# EAGLE design working (EAGLE 5.11)
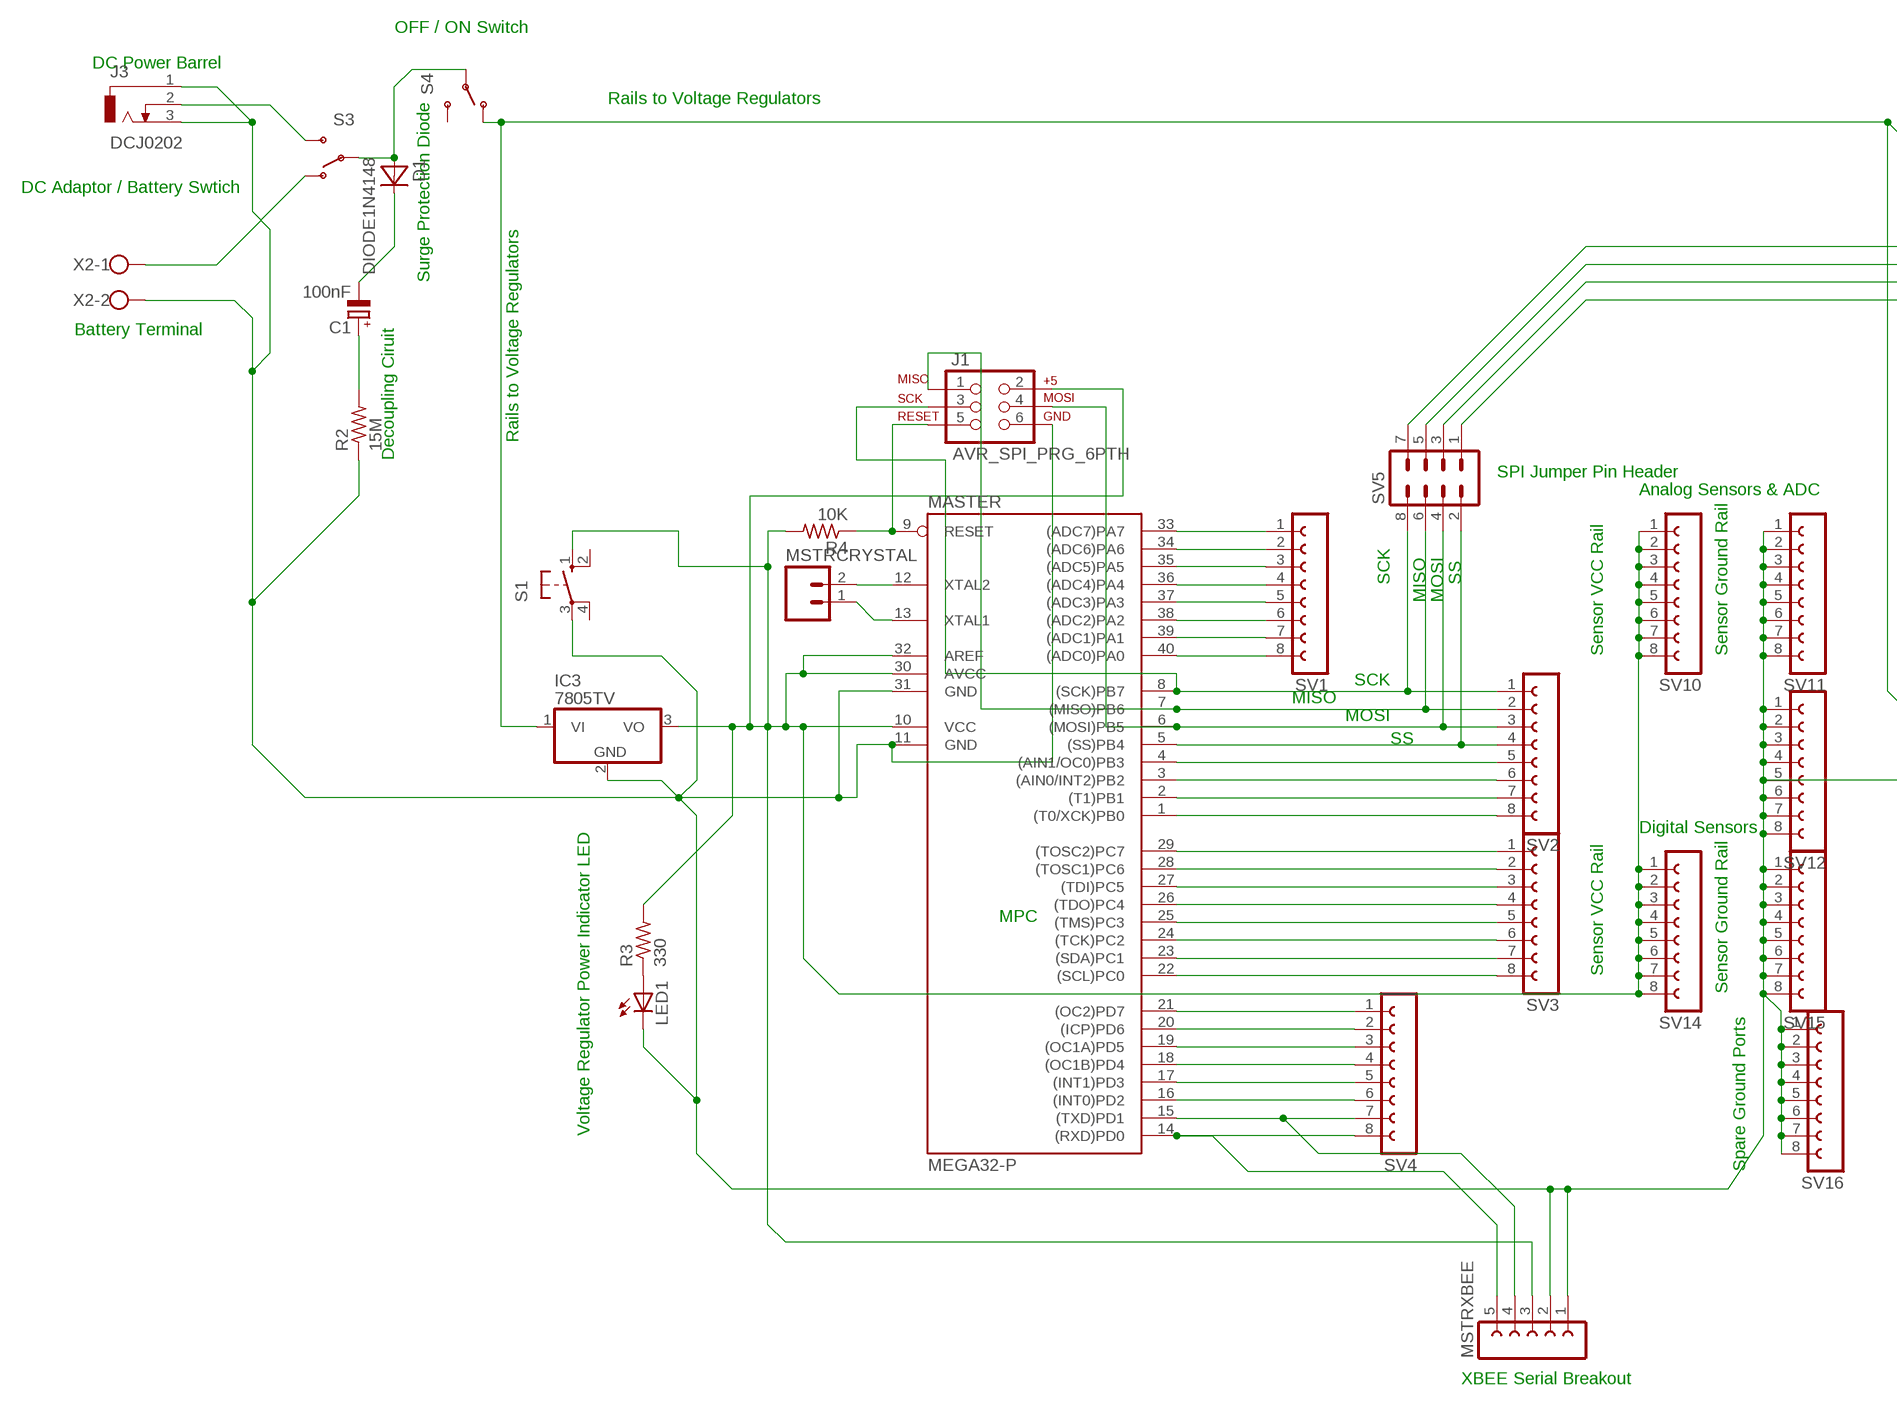
[diagram p0: schematic, sheet 1, part 1 of 2]
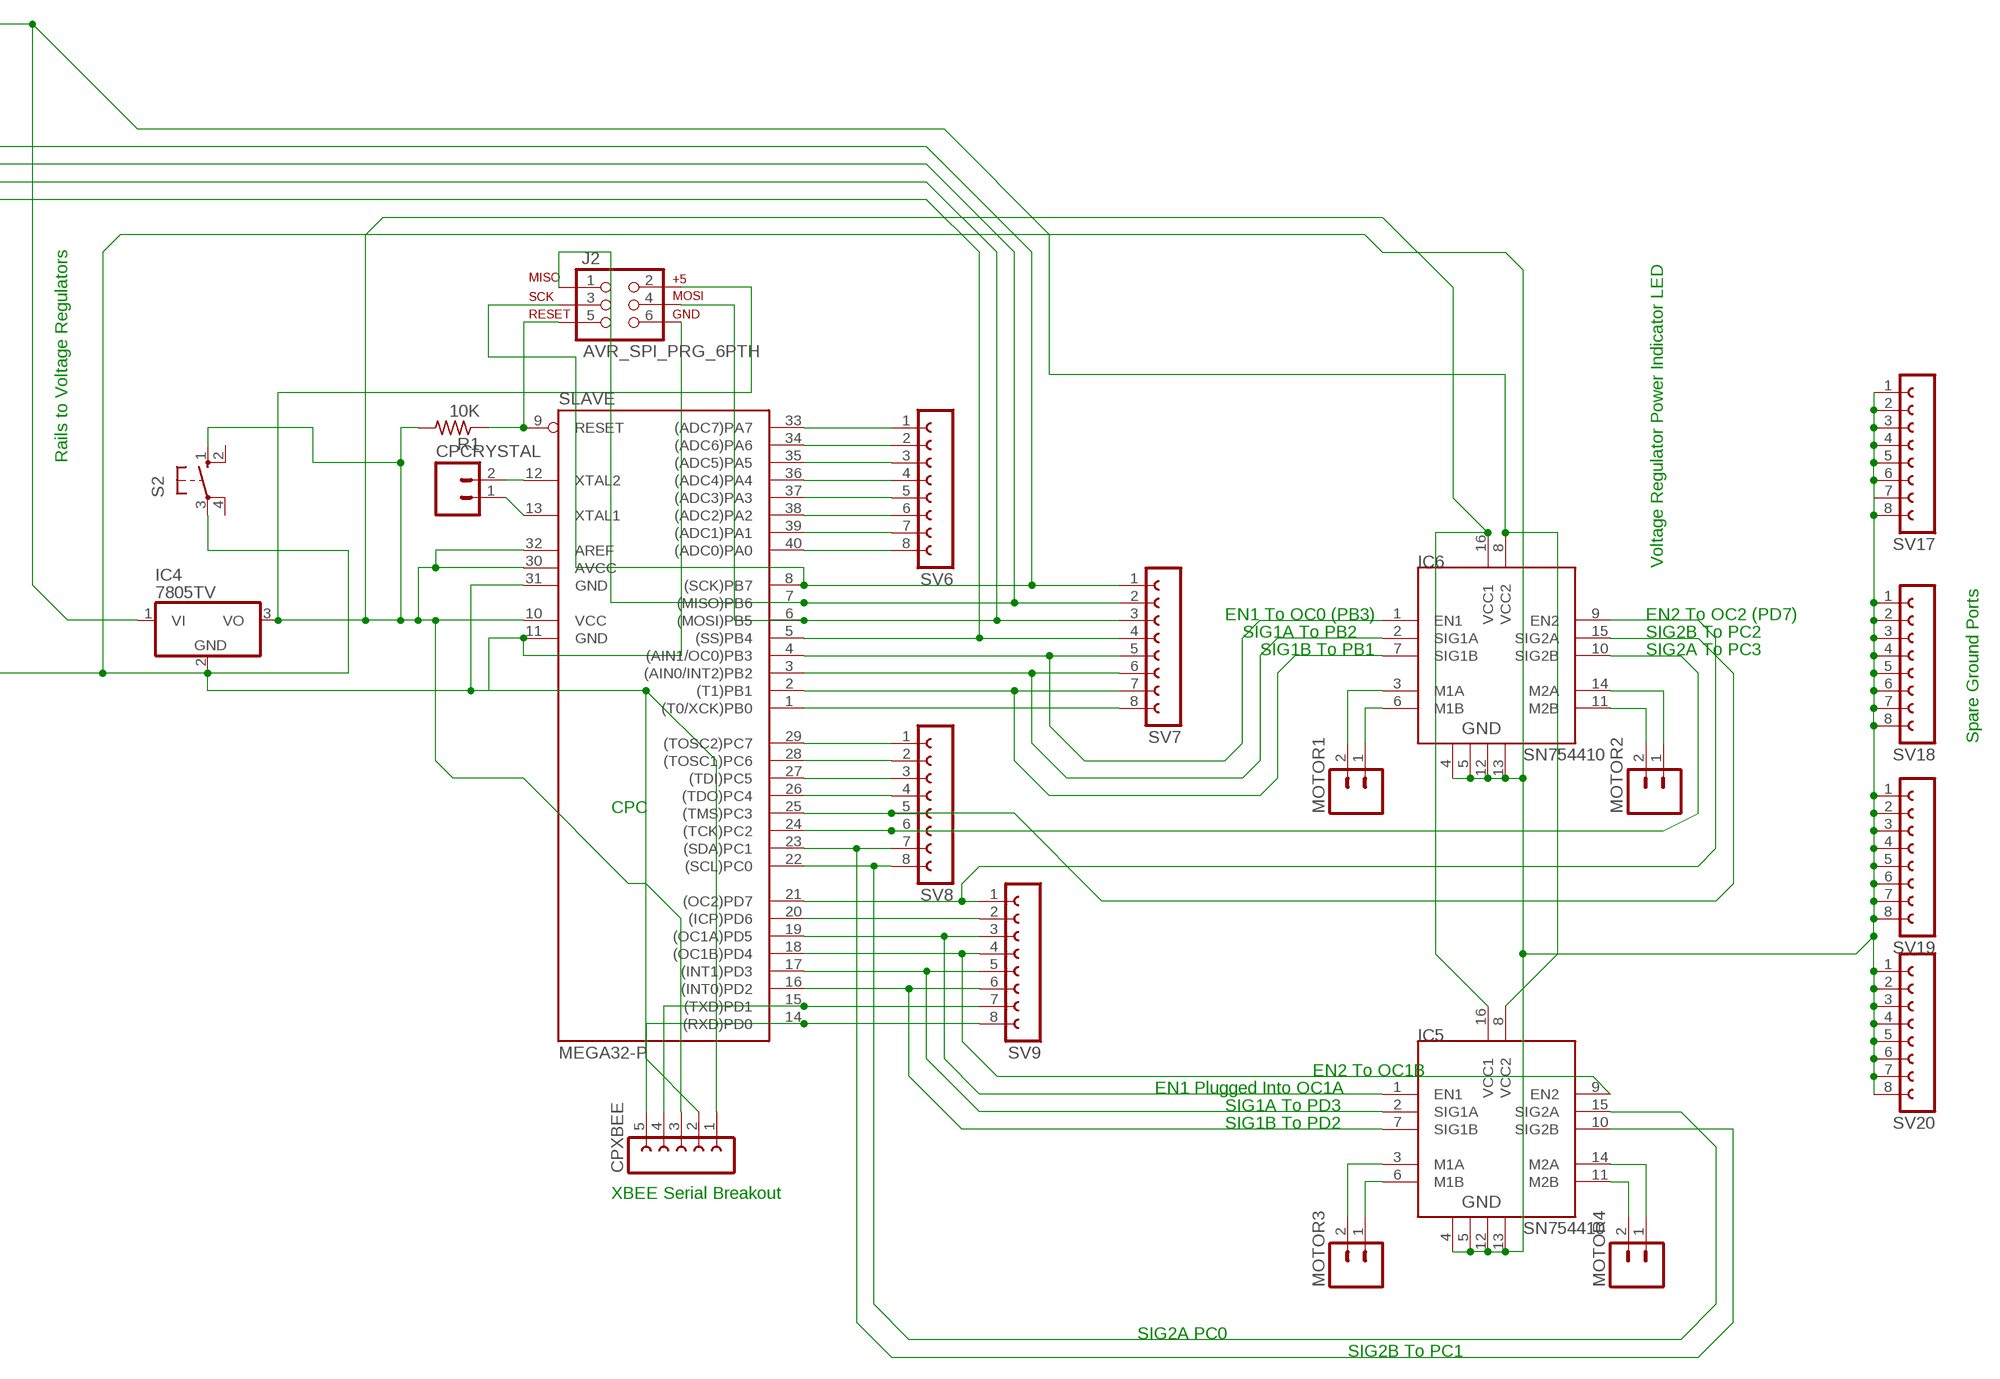
[diagram p1: schematic, sheet 1, part 2 of 2]

## Parts
C1  100nF  CPOL-EUE1.8-4  [E1,8-4]
CPCRYSTAL  M02PTH  [1X02]
CPXBEE  FE05-1  [FE05-1]
D1  DIODE1N4148  [DO-35]
IC3  7805TV  [TO220V]
IC4  7805TV  [TO220V]
IC5  SN754410  [DIP16]
IC6  SN754410  [DIP16]
J1  AVR_SPI_PRG_6PTH  [2X3]
J2  AVR_SPI_PRG_6PTH  [2X3]
J3  DCJ0202  [DCJ0202]
LED1  LED5MM  [LED5MM]
MASTER  MEGA32-P  [DIL40]
MOTOR1  M02PTH  [1X02]
MOTOR2  M02PTH  [1X02]
MOTOR3  M02PTH  [1X02]
MOTOR4  M02PTH  [1X02]
MSTRCRYSTAL  M02PTH  [1X02]
MSTRXBEE  FE05-1  [FE05-1]
R1  10K  R-US_0204/7  [0204/7]
R2  15M  R-US_0204/7  [0204/7]
R3  330  R-US_0204/7  [0204/7]
R4  10K  R-US_0204/7  [0204/7]
S1  10-XX  [B3F-10XX]
S2  10-XX  [B3F-10XX]
S3  SWITCH-SPSTPTH  [SWITCH-SPDT]
S4  SWITCH-SPSTPTH  [SWITCH-SPDT]
SLAVE  MEGA32-P  [DIL40]
SV1  FE08-1  [FE08]
SV2  FE08-1  [FE08]
SV3  FE08-1  [FE08]
SV4  FE08-1  [FE08]
SV5  MA04-2  [MA04-2]
SV6  FE08-1  [FE08]
SV7  FE08-1  [FE08]
SV8  FE08-1  [FE08]
SV9  FE08-1  [FE08]
SV10  FE08-1  [FE08]
SV11  FE08-1  [FE08]
SV12  FE08-1  [FE08]
SV14  FE08-1  [FE08]
SV15  FE08-1  [FE08]
SV16  FE08-1  [FE08]
SV17  FE08-1  [FE08]
SV18  FE08-1  [FE08]
SV19  FE08-1  [FE08]
SV20  FE08-1  [FE08]
X2  W237-102  [W237-102]

## Nets
GND: CPXBEE.1 CPXBEE.2 IC3.2(GND) IC4.2(GND) IC5.4 IC5.5 IC5.12 IC5.13 IC6.4 IC6.5 IC6.12 IC6.13 J1.6 J2.6 J3.1 J3.3 LED1.K(C) MASTER.11(GND) MASTER.31(GND) MSTRXBEE.1 MSTRXBEE.2 R2.1 S1.3(P) S2.3(P) SLAVE.11(GND) SLAVE.31(GND) SV11.1 SV11.2 SV11.3 SV11.4 SV11.5 SV11.6 SV11.7 SV11.8 SV12.1 SV12.2 SV12.3 SV12.4 SV12.5 SV12.6 SV12.7 SV12.8 SV15.1 SV15.2 SV15.3 SV15.4 SV15.5 SV15.6 SV15.7 SV15.8 SV16.1 SV16.2 SV16.3 SV16.4 SV16.5 SV16.6 SV16.7 SV16.8 SV17.1 SV17.2 SV17.3 SV17.4 SV17.5 SV17.6 SV17.8 SV18.1 SV18.2 SV18.3 SV18.4 SV18.5 SV18.6 SV18.7 SV18.8 SV19.1 SV19.2 SV19.3 SV19.4 SV19.5 SV19.6 SV19.7 SV19.8 SV20.1 SV20.2 SV20.3 SV20.4 SV20.5 SV20.6 SV20.7 SV20.8 X2.2
N$1: LED1.A R3.1
N$3: MASTER.40((ADC0)PA0) SV1.8
N$4: MASTER.39((ADC1)PA1) SV1.7
N$5: J1.5 MASTER.9(RESET) R4.1
N$6: MASTER.38((ADC2)PA2) SV1.6
N$7: MASTER.37((ADC3)PA3) SV1.5
N$9: MASTER.36((ADC4)PA4) SV1.4
N$10: MASTER.35((ADC5)PA5) SV1.3
N$11: MASTER.34((ADC6)PA6) SV1.2
N$12: MASTER.33((ADC7)PA7) SV1.1
N$13: CPXBEE.3 IC4.3(VO) IC5.16(VCC1) IC6.16(VCC1) J2.2 R1.2 S2.1(S) SLAVE.10(VCC) SLAVE.30(AVCC) SLAVE.32(AREF)
N$14: J1.4 MASTER.6((MOSI)PB5) SV2.3 SV5.4
N$15: J1.1 MASTER.7((MISO)PB6) SV2.2 SV5.6
N$16: J1.3 MASTER.8((SCK)PB7) SV2.1 SV5.8
N$17: MASTER.5((SS)PB4) SV2.4 SV5.2
N$18: MASTER.4((AIN1/OC0)PB3) SV2.5
N$19: MASTER.3((AIN0/INT2)PB2) SV2.6
N$20: MASTER.2((T1)PB1) SV2.7
N$21: MASTER.1((T0/XCK)PB0) SV2.8
N$22: MASTER.29((TOSC2)PC7) SV3.1
N$23: MASTER.28((TOSC1)PC6) SV3.2
N$24: MASTER.27((TDI)PC5) SV3.3
N$25: MASTER.26((TDO)PC4) SV3.4
N$26: MASTER.25((TMS)PC3) SV3.5
N$28: MASTER.24((TCK)PC2) SV3.6
N$29: MASTER.23((SDA)PC1) SV3.7
N$30: MASTER.22((SCL)PC0) SV3.8
N$31: MASTER.21((OC2)PD7) SV4.1
N$32: MASTER.20((ICP)PD6) SV4.2
N$33: MASTER.19((OC1A)PD5) SV4.3
N$34: MASTER.18((OC1B)PD4) SV4.4
N$35: MASTER.17((INT1)PD3) SV4.5
N$36: MASTER.16((INT0)PD2) SV4.6
N$37: MASTER.15((TXD)PD1) MSTRXBEE.4 SV4.7
N$38: MASTER.14((RXD)PD0) MSTRXBEE.5 SV4.8
N$40: C1.- D1.-
N$45: J2.5 R1.1 SLAVE.9(RESET)
N$46: SLAVE.40((ADC0)PA0) SV6.8
N$47: SLAVE.39((ADC1)PA1) SV6.7
N$48: SLAVE.38((ADC2)PA2) SV6.6
N$49: SLAVE.37((ADC3)PA3) SV6.5
N$50: SLAVE.36((ADC4)PA4) SV6.4
N$51: SLAVE.35((ADC5)PA5) SV6.3
N$52: SLAVE.34((ADC6)PA6) SV6.2
N$53: SLAVE.33((ADC7)PA7) SV6.1
N$54: J2.4 SLAVE.6((MOSI)PB5) SV5.3 SV7.3
N$55: J2.1 SLAVE.7((MISO)PB6) SV5.5 SV7.2
N$56: J2.3 SLAVE.8((SCK)PB7) SV5.7 SV7.1
N$57: SLAVE.5((SS)PB4) SV5.1 SV7.4
N$58: IC6.1(EN1) SLAVE.4((AIN1/OC0)PB3) SV7.5
N$59: D1.+ S3.2(P) S4.2(P)
N$60: IC6.7(SIG1B) SLAVE.2((T1)PB1) SV7.7
N$61: SLAVE.1((T0/XCK)PB0) SV7.8
N$62: SLAVE.29((TOSC2)PC7) SV8.1
N$63: SLAVE.28((TOSC1)PC6) SV8.2
N$64: SLAVE.27((TDI)PC5) SV8.3
N$65: SLAVE.26((TDO)PC4) SV8.4
N$66: IC6.15(SIG2A) SLAVE.25((TMS)PC3) SV8.5
N$67: IC6.10(SIG2B) SLAVE.24((TCK)PC2) SV8.6
N$68: IC5.10(SIG2B) SLAVE.23((SDA)PC1) SV8.7
N$69: IC5.15(SIG2A) SLAVE.22((SCL)PC0) SV8.8
N$70: IC6.9(EN2) SLAVE.21((OC2)PD7) SV9.1
N$71: SLAVE.20((ICP)PD6) SV9.2
N$72: IC5.1(EN1) SLAVE.19((OC1A)PD5) SV9.3
N$73: IC5.9(EN2) SLAVE.18((OC1B)PD4) SV9.4
N$75: C1.+ R2.2
N$76: IC5.7(SIG1B) SLAVE.16((INT0)PD2) SV9.6
N$77: CPXBEE.4 SLAVE.15((TXD)PD1) SV9.7
N$78: CPXBEE.5 SLAVE.14((RXD)PD0) SV9.8
N$79: IC3.1(VI) IC4.1(VI) IC5.8(VCC2) IC6.8(VCC2) S4.1(O)
N$80: IC5.14(M2A) MOTOR4.1
N$81: IC5.11(M2B) MOTOR4.2
N$82: J3.2 S3.3(S)
N$83: IC6.14(M2A) MOTOR2.1
N$84: IC6.11(M2B) MOTOR2.2
N$85: IC6.2(SIG1A) SLAVE.3((AIN0/INT2)PB2) SV7.6
N$86: IC5.6(M1B) MOTOR3.1
N$87: IC5.2(SIG1A) SLAVE.17((INT1)PD3) SV9.5
N$89: IC5.3(M1A) MOTOR3.2
N$90: IC6.6(M1B) MOTOR1.1
N$91: IC6.3(M1A) MOTOR1.2
N$93: S3.1(O) X2.1
N$94: MASTER.12(XTAL2) MSTRCRYSTAL.2
N$95: MASTER.13(XTAL1) MSTRCRYSTAL.1
N$96: CPCRYSTAL.2 SLAVE.12(XTAL2)
N$97: CPCRYSTAL.1 SLAVE.13(XTAL1)
N$98: IC3.3(VO) J1.2 MASTER.10(VCC) MASTER.30(AVCC) MASTER.32(AREF) MSTRXBEE.3 R3.2 R4.2 S1.1(S) SV10.1 SV10.2 SV10.3 SV10.4 SV10.5 SV10.6 SV10.7 SV10.8 SV14.1 SV14.2 SV14.3 SV14.4 SV14.5 SV14.6 SV14.7 SV14.8
Unconnected: S1.2(S1) S1.4(P1) S2.2(S1) S2.4(P1) S4.3(S) SV17.7

## Notes on the sheet
- OFF / ON Switch
- DC Power Barrel
- Rails to Voltage Regulators
- DC Adaptor / Battery Swtich
- Surge Protection Diode
- Battery Terminal
- Rails to Voltage Regulators
- Decoupling Ciruit
- SPI Jumper Pin Header
- Analog Sensors & ADC
- Rails to Voltage Regulators
- SCK | SS
- MISO | MOSI
- Sensor VCC Rail | Sensor Ground Rail
- SCK | Voltage Regulator Power Indicator LED
- MISO
- MOSI
- EN1 To OC0 (PB3) | EN2 To OC2 (PD7)
- SS | SIG1A To PB2 | SIG2B To PC2
- SIG1B To PB1 | SIG2A To PC3
- Digital Sensors
- Spare Ground Ports
- MPC | CPC
- Sensor VCC Rail
- Sensor Ground Rail
- Voltage Regulator Power Indicator LED
- Spare Ground Ports
- EN2 To OC1B
- EN1 Plugged Into OC1A
- SIG1A To PD3
- SIG1B To PD2
- XBEE Serial Breakout
- XBEE Serial Breakout
- SIG2A PC0
- SIG2B To PC1

## Library data of the parts
C1 = rcl:CPOL-EU: POLARIZED CAPACITOR, European symbol
CPCRYSTAL MOTOR1-MOTOR4 MSTRCRYSTAL = SparkFun:M02: Header 2 Standard 2-pin 0.1" header. Use with straight break away headers (SKU : PRT-00116), right angle break away headers (PRT-00553), swiss pins (PRT-00743), machine pins (PRT-00117), and female headers (PRT-00115). Molex polarized connector foot print use with SKU : PRT-08233 with associated crimp pins and housings.
CPXBEE MSTRXBEE = con-lsta:FE05-1: FEMALE HEADER; OC_FARNELL: unknown; OC_NEWARK: unknown
D1 = Diodes:DIODE: Diode; SPICE: D{NAME} {+.NET} {-.NET} 1N4148; SPICEMOD: .model 1N4148 D (IS=0.1PA, RS=16 CJO=2PF TT=12N BV=100 IBV=1nA)
IC3 IC4 = linear:78*: Positive VOLTAGE REGULATOR Source: http://cache.national.com/ds/LM/LM78L05.pdf http://www.fairchildsemi.com/ds/LM/LM7805.pdf
IC5 IC6 = HBridge:SN754410: Quadruple half-H driver
J1 J2 = SparkFun:AVR_SPI_PRG_6: AVR ISP 6 Pin This is the reduced ISP connector for AVR programming. Common on Arduino. This footprint will take up less PCB space and can be used with a 10-pin to 6-pin adapter such as SKU: BOB-08508
J3 = con-jack:DCJ0202: DC POWER JACK Source: DCJ0202.pdf; OC_FARNELL: unknown; OC_NEWARK: unknown
LED1 = led:LED: LED OSRAM: - CHIPLED LG R971, LG N971, LY N971, LG Q971, LY Q971, LO R971, LY R971 LH N974, LH R974 LS Q976, LO Q976, LY Q976 LO Q996 - Hyper CHIPLED LW Q18S LB Q993, LB Q99A, LB R99A - SideLED LS A670, LO A670, LY A670, LG A670, LP A670 LB A673, LV A673, LT A673, LW A673 LH A674 LY A675 LS A676, LA A676, LO A676, LY A676, LW A676 LS A679, LY A679, LG A679 - Hyper Micro SIDELED® LS Y876, LA Y876, LO Y876, LY Y876 LT Y87S - SmartLED LW L88C, LW L88S LB L89C, LB L89S, LG L890 LS L89K, LO L89K, LY L89K LS L896, LA L896, LO L896, LY L896 - TOPLED LS T670, LO T670, LY T670, LG T670, LP T670 LSG T670, LSP T670, LSY T670, LOP T670, LYG T670 LG T671, LOG T671, LSG T671 LB T673, LV T673, LT T673, LW T673 LH T674 LS T676, LA T676, LO T676, LY T676, LB T676, LH T676, LSB T676, LW T676 LB T67C, LV T67C, LT T67C, LS T67K, LO T67K, LY T67K, LW E67C LS E67B, LA E67B, LO E67B, LY E67B, LB E67C, LV E67C, LT E67C LW T67C LS T679, LY T679, LG T679 LS T770, LO T770, LY T770, LG T770, LP T770 LB T773, LV T773, LT T773, LW T773 LH T774 LS E675, LA E675, LY E675, LS T675 LS T776, LA T776, LO T776, LY T776, LB T776 LHGB T686 LT T68C, LB T68C - Hyper Mini TOPLED® LB M676 - Mini TOPLED Santana® LG M470 LS M47K, LO M47K, LY M47K Source: http://www.osram.convergy.de LUXEON: - LUMILED® LXK2-PW12-R00, LXK2-PW12-S00, LXK2-PW14-U00, LXK2-PW14-V00 LXK2-PM12-R00, LXK2-PM12-S00, LXK2-PM14-U00 LXK2-PE12-Q00, LXK2-PE12-R00, LXK2-PE12-S00, LXK2-PE14-T00, LXK2-PE14-U00 LXK2-PB12-K00, LXK2-PB12-L00, LXK2-PB12-M00, LXK2-PB14-N00, LXK2-PB14-P00, LXK2-PB14-Q00 LXK2-PR12-L00, LXK2-PR12-M00, LXK2-PR14-Q00, LXK2-PR14-R00 LXK2-PD12-Q00, LXK2-PD12-R00, LXK2-PD12-S00 LXK2-PH12-R00, LXK2-PH12-S00 LXK2-PL12-P00, LXK2-PL12-Q00, LXK2-PL12-R00 Source: www.luxeon.com KINGBRIGHT: KA-3528ASYC Source: www.kingbright.com
MASTER SLAVE = atmel:MEGA32-P: MICROCONTROLLER 32 Kbytes FLASH 2 Kbytes SRAM 1 Kbytes EEPROM USART 8-channel 10 bit ADC Source: www.atmel.com .. doc2503.pdf; MPN: ATMEGA32-16PU; OC_FARNELL: 1661729; OC_NEWARK: 51P1794
R1-R4 = resistor:R-US_: RESISTOR, American symbol
S1 S2 = switch-omron:10-XX: OMRON SWITCH; MPN: B3F-1000; OC_FARNELL: 176432; OC_NEWARK: 36M3542
S3 S4 = SparkFun:SWITCH-SPST: SPST Switch Simple slide switch. Spark Fun Electronics SKU : COM-00102
SV1-SV4 SV6-SV12 SV14-SV20 = con-lsta:FE08-1: FEMALE HEADER; OC_FARNELL: unknown; OC_NEWARK: unknown
SV5 = con-lstb:MA04-2: PIN HEADER; OC_FARNELL: unknown; OC_NEWARK: unknown
X2 = con-wago-500:W237-102: WAGO SCREW CLAMP; MPN: 237-102; OC_FARNELL: unknown; OC_NEWARK: 70K9898

## Board
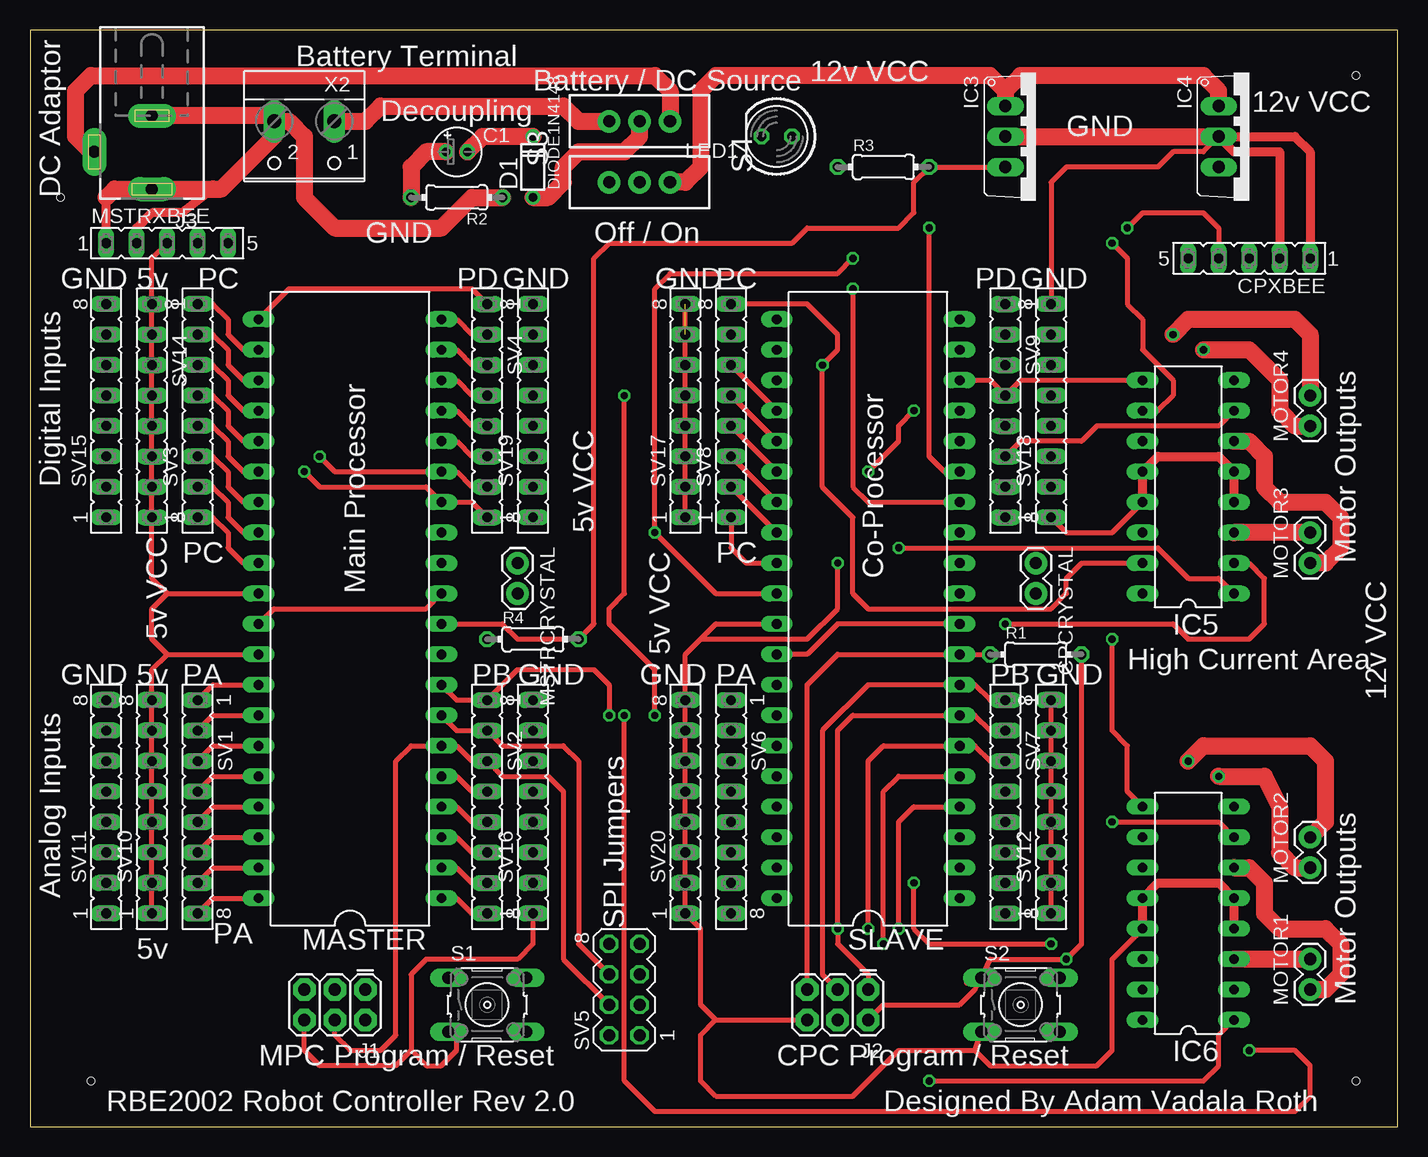
[diagram p2: board, top side]
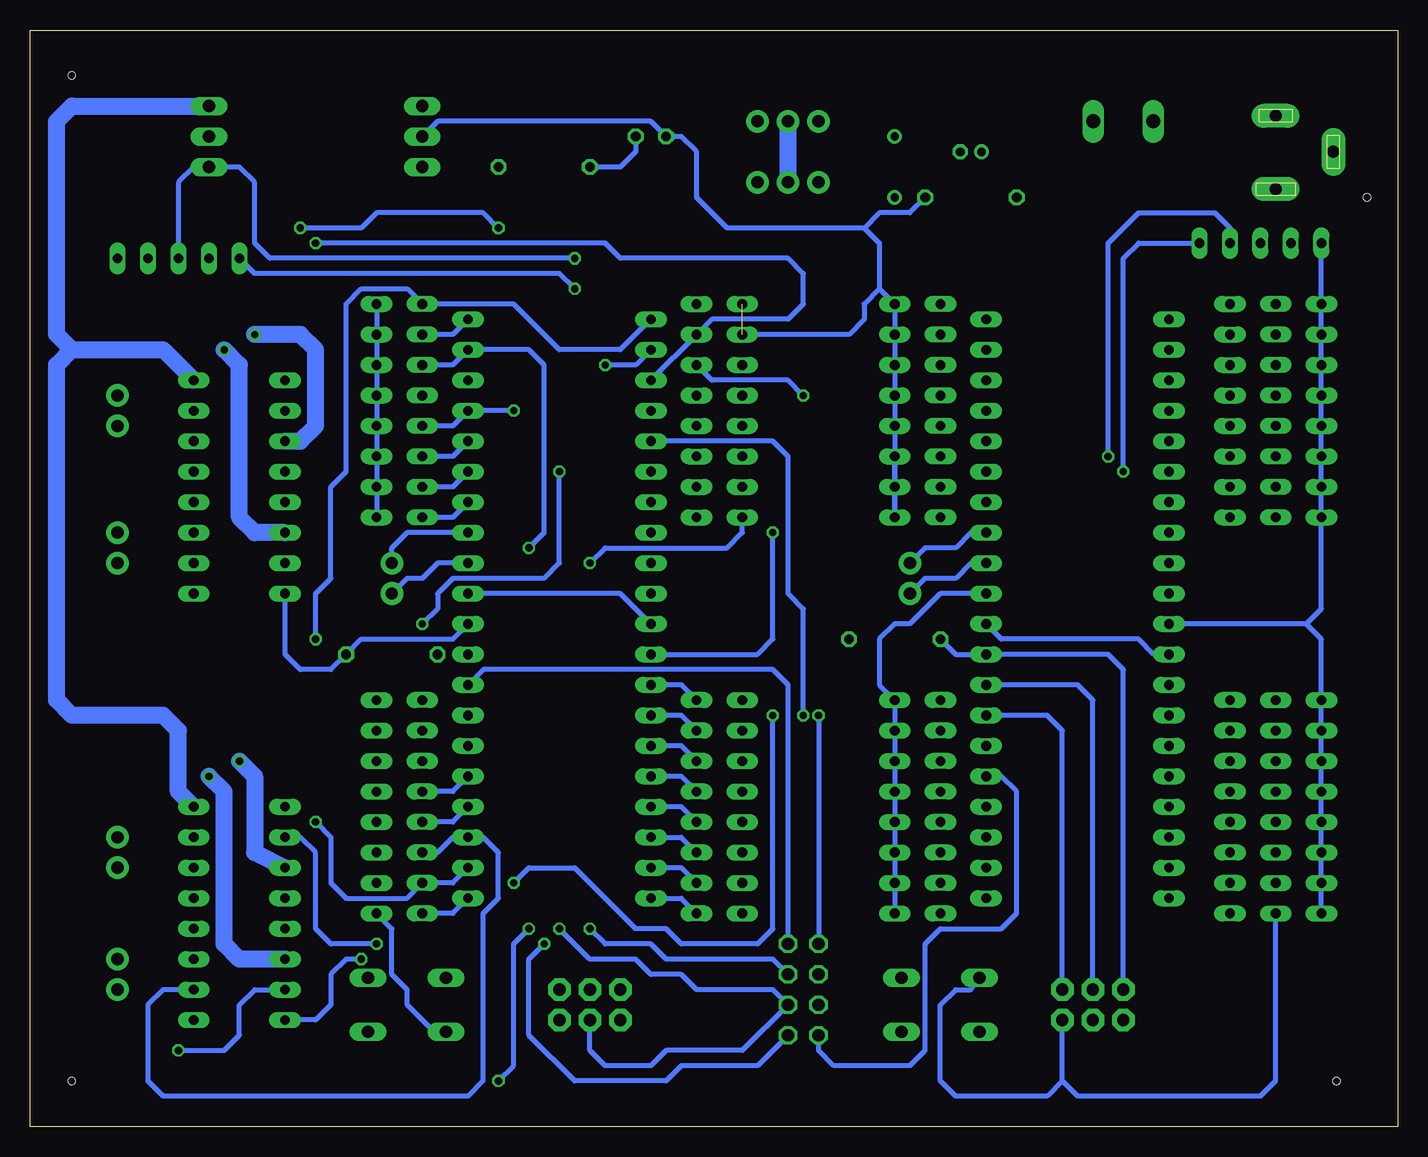
[diagram p3: board, bottom side, seen from below]

Size 113.97 x 91.43 mm. Coordinates in mm from the lower left corner, seen from the top.
Outline: 0,0 113.97,0 113.97,91.43 0,91.43 0,0
Copper layers (1*16): Top 0.035mm / dielectric 1.5mm / Bottom 0.035mm
Design rules "default": minimum track width 10mil, minimum drill 24mil, track to track 8mil, track to pad 8mil, pad to pad 8mil, via to via 8mil, smd to smd 8mil, copper to edge 40mil, drill to drill 8mil, minimum pad ring 10mil, minimum via ring 8mil, stop-mask expansion 4mil, vias tented up to drill 0mil, thermal gap 10mil
Holes 0.6 mm at 5.08,3.81 110.49,3.81 110.49,87.63 2.54,77.47

### Footprints (pad centres in the part's own frame; a part is rotated, then mirrored left to right if it is on the bottom)
E1,8-4 = drill 0.711 pad 1.168 round: + -0.889,0 | drill 0.711 pad 1.168 octagon: - 0.889,0
1X02 = drill 1.016 pad 1.88 round: 1 0,0; 2 2.54,0
FE05-1 = drill 0.813 long: 1 -5.08,0; 2 -2.54,0; 3 0,0; 4 2.54,0; 5 5.08,0
DO-35 = drill 0.7 round: + -2.54,0; - 2.54,0
TO220V = drill 1.016 long: 1 -2.54,-2.54; 2 0,-2.54; 3 2.54,-2.54
DIP16 = drill 0.813 long: 1 -10.16,-3.81; 2 -7.62,-3.81; 3 -5.08,-3.81; 4 -2.54,-3.81; 5 0,-3.81; 6 2.54,-3.81; 7 5.08,-3.81; 8 7.62,-3.81; 9 7.62,3.81; 10 5.08,3.81; 11 2.54,3.81; 12 0,3.81; 13 -2.54,3.81; 14 -5.08,3.81; 15 -7.62,3.81; 16 -10.16,3.81
2X3 = drill 1.016 pad 1.88 octagon: 1 0,0; 2 0,2.54; 3 2.54,0; 4 2.54,2.54; 5 5.08,0; 6 5.08,2.54
DCJ0202 = drill 1 pad 2 long: 1 0,3.1; 2 4.8,0; 3 0,-3
LED5MM = drill 0.813 octagon: A -1.27,0; K 1.27,0
DIL40 = drill 0.813 long: 1 -24.13,-7.62; 2 -21.59,-7.62; 3 -19.05,-7.62; 4 -16.51,-7.62; 5 -13.97,-7.62; 6 -11.43,-7.62; 7 -8.89,-7.62; 8 -6.35,-7.62; 9 -3.81,-7.62; 10 -1.27,-7.62; 11 1.27,-7.62; 12 3.81,-7.62; 13 6.35,-7.62; 14 8.89,-7.62; 15 11.43,-7.62; 16 13.97,-7.62; 17 16.51,-7.62; 18 19.05,-7.62; 19 21.59,-7.62; 20 24.13,-7.62; 21 24.13,7.62; 22 21.59,7.62; 23 19.05,7.62; 24 16.51,7.62; 25 13.97,7.62; 26 11.43,7.62; 27 8.89,7.62; 28 6.35,7.62; 29 3.81,7.62; 30 1.27,7.62; 31 -1.27,7.62; 32 -3.81,7.62; 33 -6.35,7.62; 34 -8.89,7.62; 35 -11.43,7.62; 36 -13.97,7.62; 37 -16.51,7.62; 38 -19.05,7.62; 39 -21.59,7.62; 40 -24.13,7.62
0204/7 = drill 0.813 octagon: 1 -3.81,0; 2 3.81,0
B3F-10XX = drill 1.016 long: 1 -3.251,2.261; 2 3.251,2.261; 3 -3.251,-2.261; 4 3.251,-2.261
SWITCH-SPDT = drill 1.016 pad 1.88 round: 1 0,2.54; 2 0,0; 3 0,-2.54
FE08 = drill 0.813 long: 1 -8.89,0; 2 -6.35,0; 3 -3.81,0; 4 -1.27,0; 5 1.27,0; 6 3.81,0; 7 6.35,0; 8 8.89,0
MA04-2 = drill 1.016 octagon: 1 -3.81,-1.27; 2 -3.81,1.27; 3 -1.27,-1.27; 4 -1.27,1.27; 5 1.27,-1.27; 6 1.27,1.27; 7 3.81,-1.27; 8 3.81,1.27
W237-102 = drill 1.194 long: 1 -2.5,-1.27; 2 2.5,-1.27

### Placement (x,y rotation side)
C1  35.56,81.28 0 top
CPCRYSTAL  83.82,46.99 270 top
CPXBEE  101.6,72.39 180 top
D1  41.91,80.01 90 top
IC3  83.82,82.55 270 top
IC4  101.6,82.55 270 top
IC5  96.52,54.61 90 top
IC6  96.52,19.05 90 top
J1  27.94,11.43 180 top
J2  69.85,11.43 180 top
J3  10.16,81.28 180 top
LED1  62.23,82.55 180 top
MASTER  26.67,43.18 90 top
MOTOR1  106.68,11.43 90 top
MOTOR2  106.68,21.59 90 top
MOTOR3  106.68,46.99 90 top
MOTOR4  106.68,58.42 90 top
MSTRCRYSTAL  40.64,46.99 270 top
MSTRXBEE  11.43,73.66 0 top
R1  83.82,39.37 0 top
R2  35.56,77.47 180 top
R3  71.12,80.01 0 top
R4  41.91,40.64 0 top
S1  38.1,10.16 0 top
S2  82.55,10.16 0 top
S3  50.8,83.82 90 top
S4  50.8,78.74 270 top
SLAVE  69.85,43.18 90 top
SV1  13.97,26.67 270 top
SV2  38.1,26.67 270 top
SV3  13.97,59.69 90 top
SV4  38.1,59.69 270 top
SV5  49.53,11.43 90 top
SV6  58.42,26.67 270 top
SV7  81.28,26.67 270 top
SV8  58.42,59.69 90 top
SV9  81.28,59.69 270 top
SV10  10.16,26.67 90 top
SV11  6.35,26.67 90 top
SV12  85.09,26.67 90 top
SV14  10.16,59.69 270 top
SV15  6.35,59.69 90 top
SV16  41.91,26.67 90 top
SV17  54.61,59.69 90 top
SV18  85.09,59.69 90 top
SV19  41.91,59.69 90 top
SV20  54.61,26.67 90 top
X2  22.86,82.55 180 top

### Tracks (layer width: path | path; a pad name or v marks a point on that pad's centre or on a via)
GND  (via drill 0.6 pad 0.61)  (1 unrouted)
  Top 0.406: MASTER.31 20.32,43.18 33.02,43.18 MASTER.11 | SV16.1 41.91,15.24 40.64,13.97 33.02,13.97 31.75,12.7 31.75,6.35 | 31.75,6.35 30.48,5.08 24.13,5.08 22.86,6.35 J1.6 | 31.75,6.35 33.02,5.08 34.29,5.08 35.56,6.35 35.56,7.62 S1.3 | SV18.8 85.09,78.74 86.36,80.01 93.98,80.01 95.25,81.28 97.79,81.28 IC4.2 | SV18.1 86.36,49.53 90.17,49.53 IC5.13 | v67.31,46.99 67.31,43.18 64.77,40.64 55.88,40.64 | 55.88,40.64 54.61,39.37 SV20.8 SV20.7 SV20.6 SV20.5 SV20.4 SV20.3 SV20.2 SV20.1 55.88,16.51 55.88,10.16 57.15,8.89 | SV17.8 SV17.6 SV17.5 SV17.4 SV17.3 SV17.2 SV17.1 | SV12.8 SV12.7 SV12.6 SV12.5 SV12.4 SV12.3 SV12.2 SV12.1 | 78.74,6.35 80.01,5.08 88.9,5.08 90.17,6.35 90.17,13.97 IC6.13 | 78.74,6.35 S2.3 | SLAVE.31 57.15,41.91 55.88,40.64 | 78.74,6.35 72.39,6.35 68.58,2.54 57.15,2.54 55.88,3.81 55.88,7.62 57.15,8.89 | 57.15,8.89 J2.6
  Top 0.762: IC6.13 IC6.12 93.98,20.32 99.06,20.32 IC6.5 IC6.4 | IC5.4 IC5.5 99.06,55.88 93.98,55.88 IC5.12 IC5.13 | CPXBEE.1 106.68,81.28 105.41,82.55 IC4.2 100.33,81.28 104.14,81.28 CPXBEE.2 | MSTRXBEE.1 6.35,77.47 | MSTRXBEE.2 8.89,74.93 10.16,76.2 12.7,76.2 15.24,78.18
  Top 1.397: J3.3 19.9,84.28 X2.2 | X2.2 20.32,83.78 20.32,82.55 15.95,78.18 15.24,78.18 J3.1 7.06,78.18 6.35,77.47 | IC3.2 IC4.2 | R2.1 36.83,77.47 34.29,74.93 25.4,74.93 22.86,77.47 22.86,82.55 21.59,83.82 X2.2
  Bottom 0.406: 7.62,41.91 6.35,40.64 SV11.8 SV11.7 SV11.6 SV11.5 SV11.4 SV11.3 SV11.2 SV11.1 | 7.62,41.91 6.35,43.18 SV15.1 SV15.2 SV15.3 SV15.4 SV15.5 SV15.6 SV15.7 SV15.8 MSTRXBEE.1 | SV16.1 SV16.2 SV16.3 SV16.4 SV16.5 SV16.6 SV16.7 SV16.8 43.18,36.83 43.18,40.64 41.91,41.91 40.64,41.91 38.1,44.45 MASTER.11 | SLAVE.31 64.77,44.45 SLAVE.11 | 7.62,41.91 MASTER.31 | IC3.2 80.01,83.82 62.23,83.82 LED1.K 59.69,82.55 58.42,81.28 58.42,77.47 55.88,74.93 44.45,74.93 | SV19.7 SV19.6 SV19.5 SV19.4 SV19.3 SV19.2 SV19.1 SV19.7 | SV17.1 54.61,49.53 55.88,48.26 66.04,48.26 v67.31,46.99 | SV18.8 SV18.7 SV18.6 SV18.5 SV18.4 SV18.3 SV18.2 SV18.1 | S2.3 80.29,7.9 82.55,10.16 82.55,11.43 83.82,12.7 83.82,16.51 SV12.1 | R2.1 40.64,76.2 43.18,76.2 44.45,74.93 | SV19.7 SV19.8 43.18,69.85 | 54.61,66.04 45.72,66.04 44.45,67.31 44.45,68.58 43.18,69.85 | 44.45,74.93 43.18,73.66 43.18,69.85
N$1
  Bottom 0.406: LED1.A 63.5,81.28 64.77,80.01 R3.1
N$3
  Top 0.406: SV1.8 15.24,19.05 MASTER.40
N$4
  Top 0.406: SV1.7 15.24,21.59 MASTER.39
N$5
  Bottom 0.406: J1.5 22.86,38.1 24.13,39.37 MASTER.9 36.83,39.37 R4.1
N$6
  Top 0.406: SV1.6 15.24,24.13 MASTER.38
N$7
  Top 0.406: SV1.5 15.24,26.67 MASTER.37
N$9
  Top 0.406: SV1.4 15.24,29.21 MASTER.36
N$10
  Top 0.406: SV1.3 15.24,31.75 MASTER.35
N$11
  Top 0.406: SV1.2 15.24,34.29 MASTER.34
N$12
  Top 0.406: SV1.1 15.24,36.83 MASTER.33
N$13  (via drill 0.6 pad 0.61)
  Top 0.406: S2.1 78.03,11.99 | v68.58,72.39 67.31,71.12 53.34,71.12 52.07,69.85 v52.07,49.53 57.15,44.45 SLAVE.30 | R1.2 87.63,15.24 v86.36,13.97 80.01,13.97 S2.1 | S2.1 78.74,11.43 77.47,10.16 71.12,10.16 J2.2 | SLAVE.32 64.77,39.37 67.31,41.91 SLAVE.10
  Bottom 0.406: CPXBEE.3 101.6,78.74 100.33,80.01 IC4.3 96.52,80.01 95.25,78.74 95.25,73.66 93.98,72.39 v68.58,72.39 | SLAVE.32 53.34,39.37 52.07,40.64 v52.07,49.53 | SLAVE.10 78.74,40.64 86.36,40.64 R1.2 88.9,38.1 91.44,38.1 92.71,39.37 IC5.16 | IC6.16 90.17,8.89 88.9,10.16 88.9,12.7 87.63,13.97 v86.36,13.97
N$14
  Top 0.406: SV5.4 44.45,13.97 44.45,27.94 43.18,29.21 39.37,29.21 SV2.3 36.83,30.48 35.56,31.75 MASTER.6 31.75,31.75 30.48,30.48 30.48,7.62 29.21,6.35 26.67,6.35 25.4,7.62 J1.4
N$15
  Top 0.406: MASTER.7 35.56,33.02 SV2.2 39.37,31.75 44.45,31.75 45.72,30.48 45.72,15.24 SV5.6
  Bottom 0.406: J1.1 27.94,33.02 29.21,34.29 MASTER.7
N$16  (via drill 0.6 pad 0.61)
  Top 0.406: MASTER.8 35.56,35.56 SV2.1 40.64,38.1 46.99,38.1 48.26,36.83 v48.26,34.29
  Bottom 0.406: J1.3 25.4,35.56 26.67,36.83 MASTER.8 | v48.26,34.29 SV5.8
N$17
  Top 0.406: MASTER.5 35.56,29.21 36.83,27.94 SV2.4
  Bottom 0.406: MASTER.5 33.02,29.21 31.75,27.94 31.75,17.78 33.02,16.51 38.1,16.51 39.37,15.24 39.37,6.35 40.64,5.08 46.99,5.08 48.26,6.35 SV5.2
N$18
  Top 0.406: MASTER.4 35.56,26.67 36.83,25.4 SV2.5
N$19
  Top 0.406: MASTER.3 35.56,24.13 36.83,22.86 SV2.6
N$20
  Top 0.406: MASTER.2 35.56,21.59 36.83,20.32 SV2.7
N$21
  Top 0.406: MASTER.1 35.56,19.05 36.83,17.78 SV2.8
N$22
  Top 0.406: SV3.1 15.24,50.8 16.51,49.53 16.51,48.26 17.78,46.99 MASTER.29
N$23
  Top 0.406: SV3.2 15.24,53.34 16.51,52.07 16.51,50.8 17.78,49.53 MASTER.28
N$24
  Top 0.406: SV3.3 15.24,55.88 16.51,54.61 16.51,53.34 17.78,52.07 MASTER.27
N$25
  Top 0.406: SV3.4 15.24,58.42 16.51,57.15 16.51,55.88 17.78,54.61 MASTER.26
N$26
  Top 0.406: SV3.5 15.24,60.96 16.51,59.69 16.51,58.42 17.78,57.15 MASTER.25
N$28
  Top 0.406: SV3.6 15.24,63.5 16.51,62.23 16.51,60.96 17.78,59.69 MASTER.24
N$29
  Top 0.406: SV3.7 15.24,66.04 16.51,64.77 16.51,63.5 17.78,62.23 MASTER.23
N$30
  Top 0.406: SV3.8 15.24,68.58 16.51,67.31 16.51,66.04 17.78,64.77 MASTER.22
N$31
  Top 0.406: MASTER.21 21.59,69.85 36.83,69.85 SV4.1
N$32
  Top 0.406: MASTER.20 35.56,67.31 36.83,66.04 SV4.2
N$33
  Top 0.406: MASTER.19 35.56,64.77 36.83,63.5 SV4.3
N$34
  Top 0.406: MASTER.18 35.56,62.23 36.83,60.96 SV4.4
N$35
  Top 0.406: MASTER.17 35.56,59.69 36.83,58.42 SV4.5
N$36
  Top 0.406: MASTER.16 35.56,57.15 36.83,55.88 SV4.6
N$37  (via drill 0.6 pad 0.61)
  Top 0.406: v24.13,55.88 25.4,54.61 MASTER.15 35.56,54.61 36.83,53.34 SV4.7
  Bottom 0.406: v24.13,55.88 24.13,73.66 21.59,76.2 15.24,76.2 13.97,74.93 MSTRXBEE.4
N$38  (via drill 0.6 pad 0.61)
  Top 0.406: v22.86,54.61 24.13,53.34 33.02,53.34 MASTER.14 36.83,52.07 SV4.8
  Bottom 0.406: MSTRXBEE.5 21.59,73.66 22.86,72.39 v22.86,54.61
N$40
  Top 1.397: D1.- 37.72,82.55 C1.-
N$45
  Top 0.406: R1.1 SLAVE.9 67.31,39.37 64.77,36.83 J2.5
N$46
  Bottom 0.406: SLAVE.40 59.69,19.05 SV6.8
N$47
  Bottom 0.406: SV6.7 59.69,21.59 SLAVE.39
N$48
  Bottom 0.406: SLAVE.38 59.69,24.13 SV6.6
N$49
  Bottom 0.406: SV6.5 59.69,26.67 SLAVE.37
N$50
  Bottom 0.406: SV6.4 59.69,29.21 SLAVE.36
N$51
  Bottom 0.406: SV6.3 59.69,31.75 SLAVE.35
N$52
  Bottom 0.406: SV6.2 59.69,34.29 SLAVE.34
N$53
  Bottom 0.406: SV6.1 59.69,36.83 SLAVE.33
N$54  (via drill 0.6 pad 0.61)
  Top 0.406: v69.85,16.51 69.85,30.48 71.12,31.75 SLAVE.6 78.74,31.75 80.01,30.48 SV7.3
  Bottom 0.406: v69.85,16.51 67.31,13.97 63.5,13.97 62.23,12.7 59.69,12.7 58.42,11.43 52.07,11.43 SV5.3 54.61,6.35 60.96,6.35 62.23,5.08 66.04,5.08 67.31,6.35 J2.4
N$55  (via drill 0.6 pad 0.61)
  Top 0.406: J2.1 69.85,12.7 67.31,15.24 v67.31,16.51 67.31,33.02 68.58,34.29 SLAVE.7 78.74,34.29 80.01,33.02 SV7.2
  Bottom 0.406: v67.31,16.51 66.04,15.24 62.23,15.24 60.96,13.97 52.07,13.97 SV5.5
N$56
  Top 0.406: J2.3 66.04,12.7 66.04,33.02 69.85,36.83 SLAVE.8 78.74,36.83 80.01,35.56 SV7.1
  Bottom 0.406: SV5.7 50.8,36.83 52.07,38.1 76.2,38.1 SLAVE.8
N$57  (via drill 0.6 pad 0.61)
  Top 0.406: v71.12,15.24 71.12,27.94 72.39,29.21 SLAVE.5
  Bottom 0.406: SLAVE.5 78.74,27.94 SV7.4 | v71.12,15.24 72.39,13.97 72.39,7.62 68.58,3.81 60.96,3.81 59.69,5.08 53.34,5.08 SV5.1
N$58  (via drill 0.6 pad 0.61)
  Top 0.406: v72.39,16.51 72.39,25.4 73.66,26.67 SLAVE.4 | v74.93,3.81 97.79,3.81 99.06,5.08 99.06,7.62 IC6.1
  Bottom 0.406: SLAVE.4 78.74,25.4 SV7.5 | v74.93,3.81 73.66,5.08 73.66,15.24 v72.39,16.51
N$59
  Top 1.397: S3.2 50.8,82.55 49.53,81.28 45.72,81.28 44.45,80.01 44.45,78.74 43.18,77.47 D1.+
  Bottom 1.397: S4.2 S3.2
N$60  (via drill 0.6 pad 0.61)
  Top 0.406: IC6.7 99.06,25.4 v90.17,25.4
  Bottom 0.406: SLAVE.2 78.74,20.32 SV7.7 82.55,19.05 87.63,19.05 88.9,20.32 88.9,24.13 v90.17,25.4
N$61
  Bottom 0.406: SLAVE.1 78.74,17.78 SV7.8
N$62
  Top 0.406: SV8.1 58.42,48.26 59.69,46.99 SLAVE.29
N$63
  Top 0.406: SLAVE.28 SV8.2
N$64
  Top 0.406: SLAVE.27 SV8.3
N$65
  Top 0.406: SLAVE.26 SV8.4
N$66  (via drill 0.6 pad 0.61)
  Top 0.406: SLAVE.25 SV8.5 | v101.6,6.35 105.41,6.35 106.68,5.08 106.68,2.54 105.41,1.27 52.07,1.27 49.53,3.81 v49.53,34.29
  Bottom 0.406: IC6.15 95.25,11.43 96.52,10.16 96.52,7.62 97.79,6.35 v101.6,6.35 | v49.53,34.29 49.53,43.18 50.8,44.45 50.8,55.88 52.07,57.15 SLAVE.25
N$67  (via drill 0.6 pad 0.61)
  Top 0.406: SV8.6 SLAVE.24 | v52.07,34.29 52.07,38.1 48.26,41.91 48.26,43.18 49.53,44.45 v49.53,60.96 | v85.09,15.24 74.93,15.24 73.66,16.51 v73.66,20.32
  Bottom 0.406: IC6.10 91.44,24.13 90.17,22.86 90.17,16.51 88.9,15.24 v85.09,15.24 | v52.07,34.29 52.07,16.51 53.34,15.24 59.69,15.24 60.96,16.51 63.5,16.51 68.58,21.59 72.39,21.59 v73.66,20.32 | v49.53,60.96 50.8,62.23 57.15,62.23 SV8.6
N$68  (via drill 0.6 pad 0.61)
  Top 0.406: v90.17,73.66 91.44,72.39 91.44,68.58 92.71,67.31 92.71,64.77 95.25,62.23 95.25,60.96 93.98,59.69 IC5.10
  Bottom 0.406: SLAVE.23 SV8.7 57.15,67.31 50.8,67.31 49.53,68.58 49.53,71.12 50.8,72.39 64.77,72.39 66.04,73.66 v90.17,73.66
N$69  (via drill 0.6 pad 0.61)
  Top 0.406: IC5.15 87.63,46.99 86.36,45.72 86.36,44.45 85.09,43.18 69.85,43.18 68.58,44.45 68.58,50.8 66.04,53.34 v66.04,63.5 67.31,64.77 67.31,66.04 64.77,68.58 SV8.8
  Bottom 0.406: SLAVE.22 63.5,63.5 v66.04,63.5
N$70  (via drill 0.6 pad 0.61)
  Top 0.406: IC6.9 91.44,27.94 91.44,31.75 90.17,33.02 v90.17,40.64
  Bottom 0.406: SLAVE.21 64.77,64.77 69.85,64.77 73.66,68.58 SV9.1 82.55,69.85 86.36,69.85 87.63,68.58 87.63,54.61 88.9,53.34 88.9,45.72 90.17,44.45 v90.17,40.64
N$71
  Bottom 0.406: SLAVE.20 78.74,66.04 SV9.2
N$72  (via drill 0.6 pad 0.61)
  Top 0.406: IC5.1 99.06,45.72 96.52,45.72 93.98,48.26 v72.39,48.26
  Bottom 0.406: SV9.3 78.74,63.5 SLAVE.19 72.39,64.77 71.12,63.5 71.12,49.53 v72.39,48.26
N$73
  Top 0.406: IC5.9 82.55,62.23 SV9.4 80.01,62.23 SLAVE.18
N$75
  Top 1.397: C1.+ 33.02,81.28 31.75,80.01 R2.2
N$76
  Top 0.406: IC5.7 99.06,58.42 88.9,58.42 87.63,57.15 82.55,57.15 SV9.6
  Bottom 0.406: SLAVE.16 78.74,55.88 SV9.6
N$77  (via drill 0.6 pad 0.61)
  Top 0.406: CPXBEE.4 99.06,74.93 97.79,76.2 92.71,76.2 v91.44,74.93 | v74.93,74.93 74.93,55.88 76.2,54.61 SLAVE.15
  Bottom 0.406: SLAVE.15 78.74,53.34 SV9.7 | v91.44,74.93 86.36,74.93 85.09,76.2 76.2,76.2 v74.93,74.93
N$78  (via drill 0.6 pad 0.61)
  Top 0.406: v68.58,69.85 68.58,53.34 69.85,52.07 SLAVE.14
  Bottom 0.406: SLAVE.14 78.74,50.8 SV9.8 | CPXBEE.5 95.25,71.12 69.85,71.12 v68.58,69.85
N$79
  Top 1.397: 81.28,86.36 IC3.1 | 81.28,86.36 80.01,87.63 57.15,87.63 55.88,86.36 55.88,80.01 54.61,78.74 S4.1 | IC4.1 99.06,86.36 97.79,87.63 82.55,87.63 81.28,86.36
  Bottom 1.397: IC5.8 102.87,64.77 110.49,64.77 | 110.49,64.77 111.76,66.04 111.76,83.82 110.49,85.09 IC4.1 | IC6.8 101.6,27.94 101.6,33.02 102.87,34.29 110.49,34.29 111.76,35.56 111.76,63.5 110.49,64.77
N$80  (via drill 0.6 pad 0.61)
  Top 1.397: MOTOR4.1 105.41,58.42 104.14,59.69 104.14,62.23 101.6,64.77 v97.79,64.77
  Bottom 1.397: v97.79,64.77 96.52,63.5 96.52,50.8 95.25,49.53 IC5.14
N$81  (via drill 0.6 pad 0.61)
  Top 1.397: MOTOR4.2 106.68,66.04 105.41,67.31 96.52,67.31 v95.25,66.04
  Bottom 1.397: IC5.11 91.44,57.15 90.17,58.42 90.17,64.77 91.44,66.04 v95.25,66.04
N$82
  Top 1.397: J3.2 5.08,81.28 3.81,82.55 3.81,86.36 5.08,87.63 52.07,87.63 53.34,86.36 S3.3
N$83  (via drill 0.6 pad 0.61)
  Top 1.397: v99.06,29.21 102.87,29.21 104.14,26.67 104.14,22.86 105.41,21.59 MOTOR2.1
  Bottom 1.397: v99.06,29.21 97.79,27.94 97.79,15.24 96.52,13.97 IC6.14
N$84  (via drill 0.6 pad 0.61)
  Top 1.397: v96.52,30.48 97.79,31.75 106.68,31.75 107.95,30.48 107.95,25.4 MOTOR2.2
  Bottom 1.397: v96.52,30.48 95.25,29.21 95.25,22.86 IC6.11
N$85
  Bottom 0.406: IC6.2 102.87,11.43 104.14,10.16 104.14,3.81 102.87,2.54 77.47,2.54 76.2,3.81 76.2,17.78 74.93,19.05 74.93,22.86 76.2,24.13 SLAVE.3 78.74,24.13 80.01,22.86 SV7.6
N$86
  Top 1.397: IC5.6 101.6,57.15 102.87,55.88 102.87,53.34 104.14,52.07 107.95,52.07 109.22,50.8 109.22,48.26 107.95,46.99 MOTOR3.1
N$87  (via drill 0.6 pad 0.61)
  Top 0.406: IC5.2 101.6,46.99 102.87,45.72 102.87,41.91 101.6,40.64 96.52,40.64 95.25,41.91 v81.28,41.91 | v69.85,54.61 72.39,57.15 72.39,58.42 v73.66,59.69
  Bottom 0.406: SV9.5 78.74,58.42 SLAVE.17 v73.66,59.69 | v81.28,41.91 80.01,43.18 80.01,44.45 78.74,45.72 71.12,45.72 69.85,46.99 v69.85,54.61
N$89
  Top 1.397: MOTOR3.2 IC5.3
N$90
  Top 1.397: IC6.6 101.6,21.59 102.87,20.32 102.87,17.78 104.14,16.51 107.95,16.51 109.22,15.24 109.22,12.7 107.95,11.43 MOTOR1.1
N$91
  Top 1.397: MOTOR1.2 IC6.3
N$93
  Top 1.397: X2.1 27.94,83.82 29.21,85.09 44.45,85.09 45.72,83.82 S3.1
N$94
  Bottom 0.406: MASTER.12 35.56,46.99 36.83,45.72 39.37,45.72 MSTRCRYSTAL.2
N$95
  Bottom 0.406: MASTER.13 35.56,49.53 36.83,48.26 39.37,48.26 MSTRCRYSTAL.1
N$96
  Bottom 0.406: SLAVE.12 80.01,46.99 81.28,45.72 82.55,45.72 CPCRYSTAL.2
N$97
  Bottom 0.406: SLAVE.13 82.55,49.53 83.82,48.26 CPCRYSTAL.1
N$98
  Top 0.406: MSTRXBEE.3 10.16,72.39 SV14.1 SV14.2 SV14.3 SV14.4 SV14.5 SV14.6 SV14.7 SV14.8 10.16,45.72 11.43,44.45 | 11.43,44.45 MASTER.30 | 11.43,39.37 10.16,38.1 SV10.8 SV10.7 SV10.6 SV10.5 SV10.4 SV10.3 SV10.2 SV10.1 | IC3.3 R3.2 73.66,78.74 73.66,76.2 72.39,74.93 64.77,74.93 63.5,73.66 48.26,73.66 46.99,72.39 46.99,41.91 R4.2 40.64,40.64 39.37,41.91 MASTER.10 | 11.43,39.37 MASTER.32 | 11.43,39.37 10.16,40.64 10.16,43.18 11.43,44.45
  Bottom 0.406: S1.1 35.56,11.43 36.83,11.43 38.1,10.16 38.1,3.81 36.83,2.54 29.21,2.54 27.94,3.81 | 27.94,3.81 26.67,2.54 11.43,2.54 10.16,3.81 SV10.1 | 27.94,3.81 J1.2 | MASTER.32 20.32,39.37 21.59,40.64 33.02,40.64 MASTER.10

### Text on the board
_tsilk: Battery Terminal | 12v VCC | Battery / DC Source | 12v VCC | Decoupling | GND | DC Adaptor | GND | Off / On | GND | 5v | PC | PD | GND | GND | PC | PD | GND | Digital Inputs | 5v VCC | PC | PC | Motor Outputs | Co-Processor | Main Processor | 5v VCC | 5v VCC | High Current Area | GND | 5v | PA | PB | GND | GND | PA | PB | GND | 12v VCC | Analog Inputs | SPI Jumpers | PA | 5v | Motor Outputs | MPC Program / Reset | CPC Program / Reset | RBE2002 Robot Controller Rev 2.0 | Designed By Adam Vadala Roth